# EAGLE design reader-and-latch-client-V2016-4-19 (EAGLE 7.5.0)
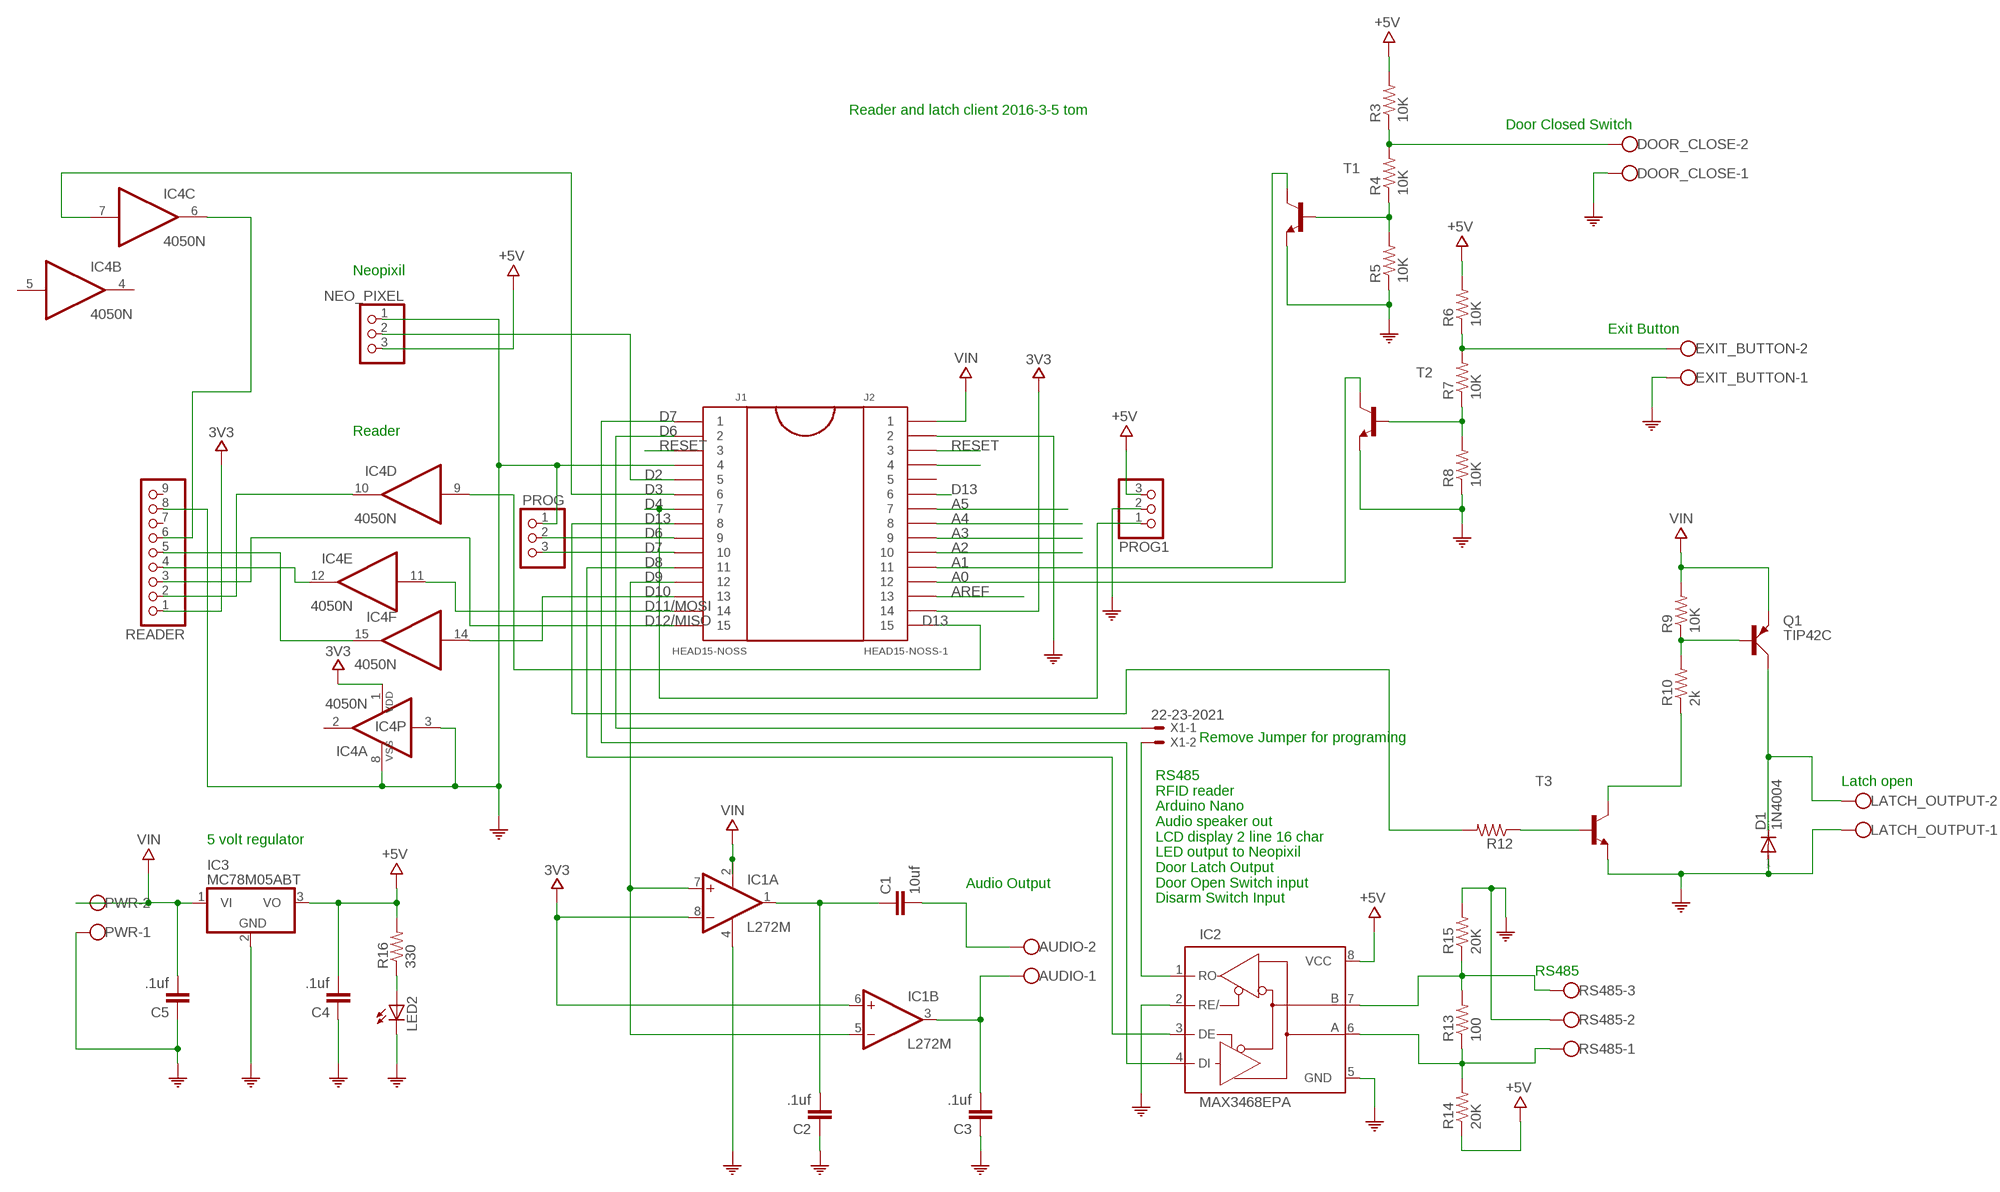
[diagram p0: schematic, sheet 1]

## Parts
AUDIO  W237-102  [W237-102]
C1  10uf  C22/6  [C22.5B6]
C2  .1uf  C5/2.5  [C5B2.5]
C3  .1uf  C5/2.5  [C5B2.5]
C4  .1uf  C5/2.5  [C5B2.5]
C5  .1uf  C5/2.5  [C5B2.5]
D1  1N4004  [DO41-10]
DOOR_CLOSE  W237-102  [W237-102]
EXIT_BUTTON  W237-102  [W237-102]
IC1  L272M  [DIL08]
IC2  MAX3468EPA  [DIL08]
IC3  MC78M05ABT  [TO220V]
IC4  4050N  [DIL16]
J1  HEAD15-NOSS  [HEAD15-NOSS]
J2  HEAD15-NOSS-1  [HEAD15-NOSS-1]
LATCH_OUTPUT  W237-102  [W237-102]
LED2  LED3MM  [LED3MM]
NEO_PIXEL  PINHD-1X3  [1X03]
PROG  PINHD-1X3  [1X03]
PROG1  PINHD-1X3  [1X03]
PWR  W237-102  [W237-102]
Q1  TIP42C  [TO220AV]
R3  10K  R-US_0207/10  [0207/10]
R4  10K  R-US_0207/10  [0207/10]
R5  10K  R-US_0207/10  [0207/10]
R6  10K  R-US_0207/10  [0207/10]
R7  10K  R-US_0207/10  [0207/10]
R8  10K  R-US_0207/10  [0207/10]
R9  10K  R-US_0207/10  [0207/10]
R10  2k  R-US_0207/10  [0207/10]
R12  R-US_0207/10  [0207/10]
R13  100  R-US_0207/10  [0207/10]
R14  20K  R-US_0207/10  [0207/10]
R15  20K  R-US_0207/10  [0207/10]
R16  330  R-US_0207/10  [0207/10]
READER  PINHD-1X9  [1X09]
RS485  W237-103  [W237-103]
T1  2N3904-NPN-TO92-EBC  [TO92-EBC]
T2  2N3904-NPN-TO92-EBC  [TO92-EBC]
T3  2N3904-NPN-TO92-EBC  [TO92-EBC]
X1  22-23-2021  [22-23-2021]

## Nets
3V3: IC1.6(B:+IN) IC1.8(A:-IN) IC4.1(P:VDD) J2.14 READER.1
+5V: C4.2 IC2.8(VCC) IC3.3(VO) NEO_PIXEL.3 PROG1.3 R3.2 R6.2 R14.1 R16.2
A0: J2.12 T2.C
A1: J2.11 T1.C
A2: J2.10
A3: J2.9
A4: J2.8
A5: J2.7
AREF: J2.13
COM: C2.1 C3.1 C4.1 C5.1 D1.A DOOR_CLOSE.1 EXIT_BUTTON.1 IC1.4(P:GND) IC2.2(RE/) IC2.5(GND) IC3.2(GND) IC4.3(A:I) IC4.8(P:VSS) J1.4 J2.2 LATCH_OUTPUT.1 LED2.K(C) NEO_PIXEL.1 PROG1.2 PROG.1 PWR.1 R5.1 R8.1 R15.2 READER.8 RS485.2 T1.E T2.E T3.E
D2: J1.5 NEO_PIXEL.2
D3: IC4.7(C:I) J1.6
D4: J1.7 PROG1.1
D6: J1.2 X1.1
D7: IC2.4(DI) J1.1
D8: IC2.3(DE) J1.11
D9: IC1.5(B:-IN) IC1.7(A:+IN) J1.12
D10: IC4.14(F:I) J1.13
D11/MOSI: IC4.11(E:I) J1.14
D12/MISO: J1.15 READER.3
D13: J1.8 R12.2
N$1: D1.C LATCH_OUTPUT.2 Q1.C
N$2: R12.1 T3.B
N$3: IC4.6(C:O) READER.6
N$4: IC2.7(B) R13.2 R15.1 RS485.3
N$5: IC2.6(A) R13.1 R14.2 RS485.1
N$6: J2.6
N$7: J1.9 PROG.2
N$8: J2.4
N$9: C1.1 C2.2 IC1.1(A:OUT)
N$10: AUDIO.2 C1.2
N$11: AUDIO.1 C3.2 IC1.3(B:OUT)
N$12: LED2.A R16.1
N$13: R4.1 R5.2 T1.B
N$14: DOOR_CLOSE.2 R3.1 R4.2
N$15: R7.1 R8.2 T2.B
N$16: EXIT_BUTTON.2 R6.1 R7.2
N$17: R10.1 T3.C
N$18: Q1.B R9.1 R10.2
N$19: IC4.10(D:O) READER.2
N$20: IC4.12(E:O) READER.4
N$21: IC4.15(F:O) READER.5
N$22: J1.10 PROG.3
N$23: IC4.9(D:I) J2.15
N$24: IC2.1(RO) X1.2
RESET: J1.3 J2.3
VIN: C5.2 IC1.2(P:V+) IC3.1(VI) J2.1 PWR.2 Q1.E R9.2
Unconnected: IC4.2(A:O) IC4.4(B:O) IC4.5(B:I) J2.5 READER.7 READER.9

## Notes on the sheet
- Reader and latch client 2016-3-5 tom
- Door Closed Switch
- Neopixil
- Exit Button
- Reader
- Remove Jumper for programing
- Latch open
- 5 volt regulator
- Audio Output
- RS485
  RFID reader
  Arduino Nano
  Audio speaker out
  LCD display 2 line 16 char
  LED output to Neopixil
  Door Latch Output
  Door Open Switch input
  Disarm Switch Input
- RS485

## Library data of the parts
AUDIO DOOR_CLOSE EXIT_BUTTON LATCH_OUTPUT PWR = con-wago-500:W237-102: WAGO SCREW CLAMP; MPN: 237-102; OC_FARNELL: unknown; OC_NEWARK: 70K9898
C1-C5 = capacitor-wima:C: CAPACITOR naming: grid - package width
D1 = diode:1N4004: DIODE general purpose rectifier, 1 A
IC1 = linear:L272: OP AMP
IC2 = maxim:MAX34*: +5V, Fail-Safe, 40Mbps, Profibus RS-485/RS-422 Transceivers Source: MAX3465-MAX3469.pdf; MPN: MAX3468EPA+; OC_FARNELL: unknown; OC_NEWARK: 78M5804
IC3 = linear:MC78M: 500 mA Positive Voltage Regulators Source: Data sheet <http://www.onsemi.com/pub_link/Collateral/MC78M00-D.PDF>
IC4 = 40xx:4050: Hex non-inverting BUFFER
J1 = MyCON2:HEAD15-NOSS
J2 = MyCON2:HEAD15-NOSS-1
LED2 = SparkFun-LED:LED: LEDs Standard schematic elements and footprints for 5mm, 3mm, 1206, and 0603 sized LEDs. 5mm - Spark Fun Electronics SKU : COM-00529 (and others)
NEO_PIXEL PROG PROG1 = pinhead:PINHD-1X3: PIN HEADER
Q1 = transistor-power:TIP42C: PNP TRANSISTOR
R3-R10 R12-R16 = resistor:R-US_: RESISTOR, American symbol
READER = pinhead:PINHD-1X9: PIN HEADER
RS485 = con-wago-500:W237-103: WAGO SCREW CLAMP; MPN: 237-103; OC_FARNELL: unknown; OC_NEWARK: 18M7116
T1-T3 = transistor-neu-to92:*-NPN-: NPN Transistror
X1 = con-molex:22-23-2021: .100" (2.54mm) Center Header - 2 Pin; MF: MOLEX; MPN: 22-23-2021; OC_FARNELL: 1462926; OC_NEWARK: 25C3832

## Board
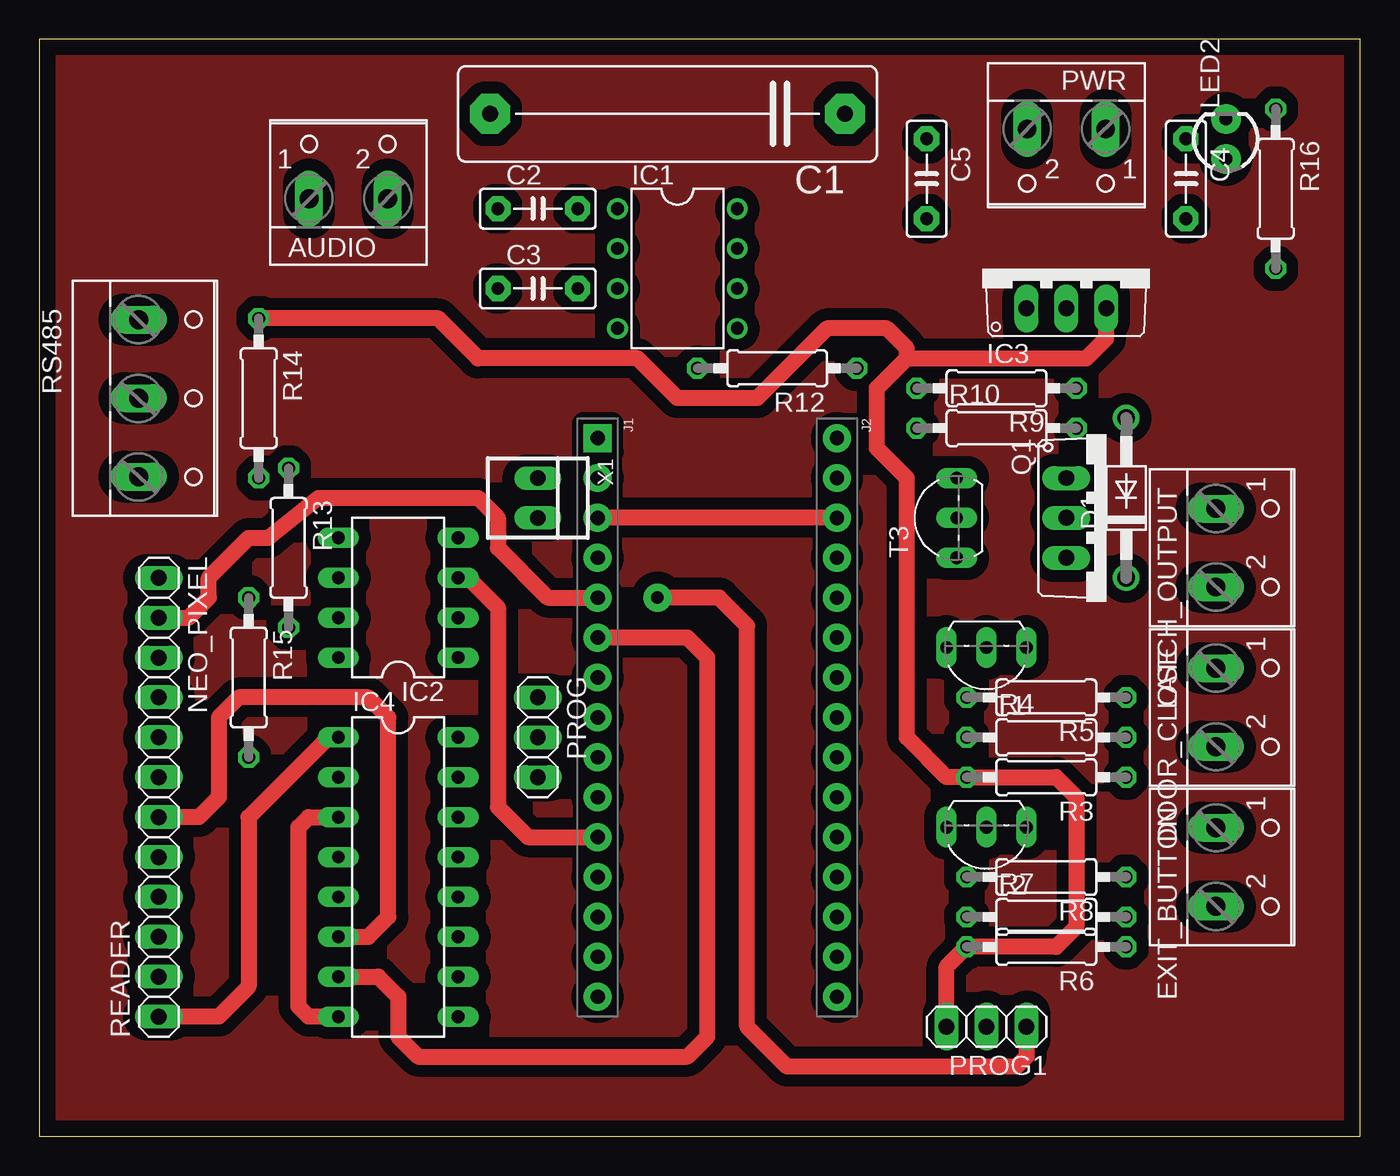
[diagram p1: board, top side]
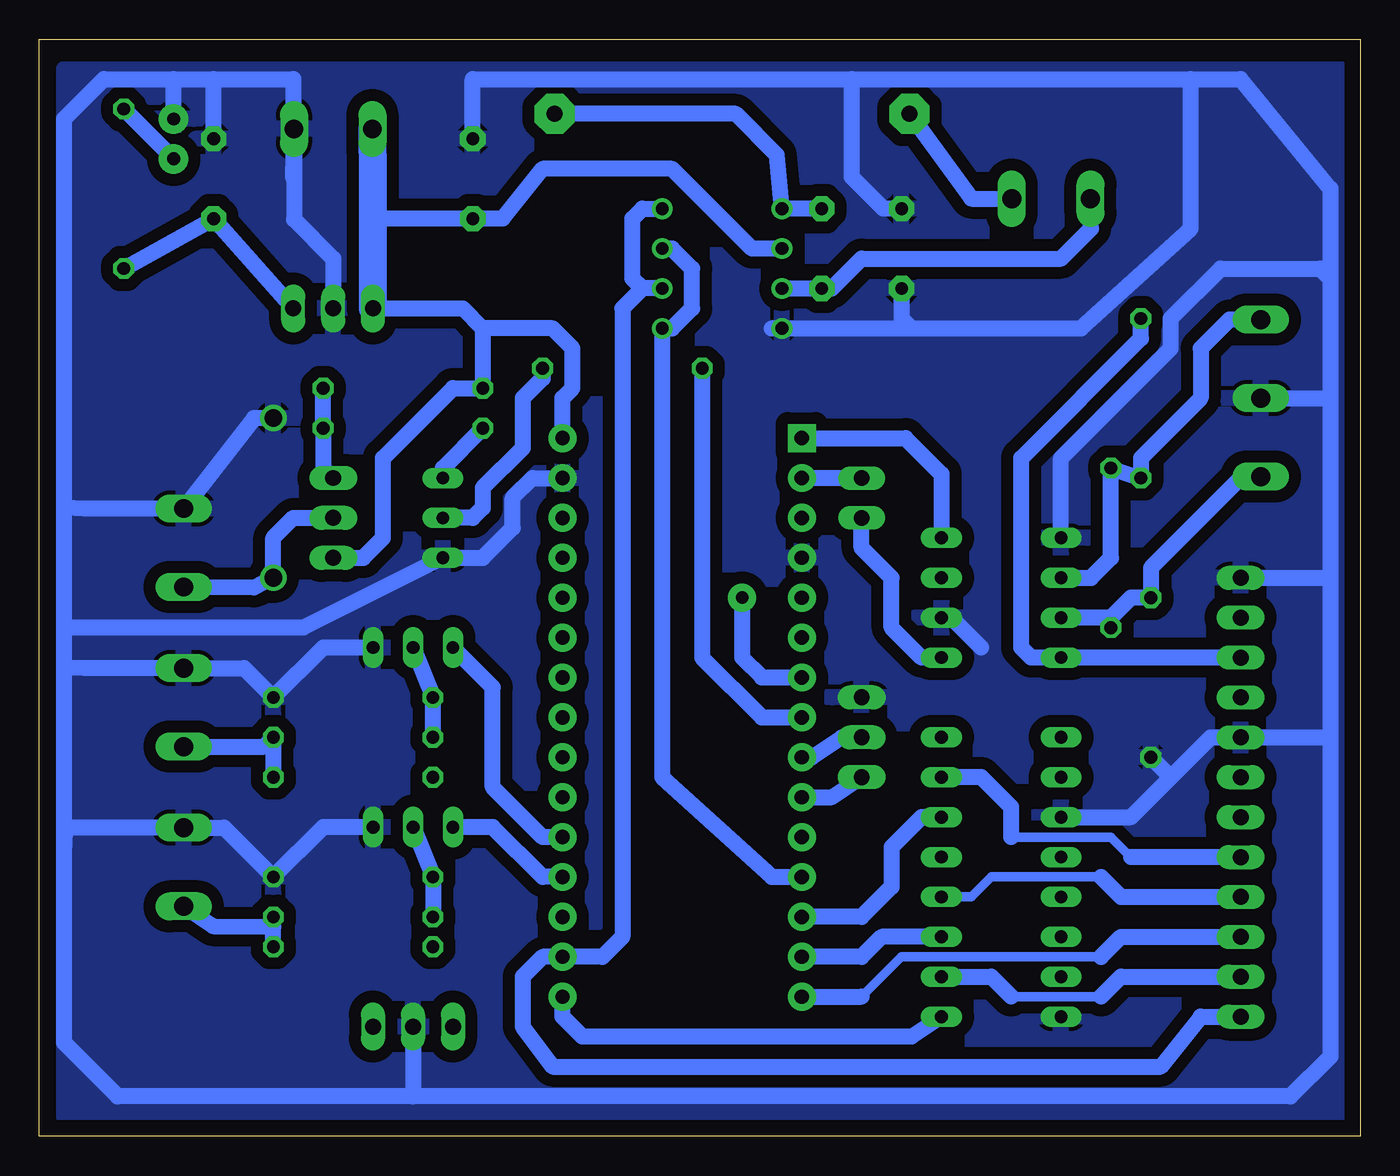
[diagram p2: board, bottom side, seen from below]

Size 84.12 x 69.84 mm. Coordinates in mm from the lower left corner, seen from the top.
Outline: 0,0 84.12,0 84.12,69.84 0,69.84 0,0
Copper layers (1*16): Top 0.035mm / dielectric 1.5mm / Bottom 0.035mm
Design rules "default *": minimum track width 10mil, minimum drill 24mil, track to track 30mil, track to pad 30mil, pad to pad 30mil, via to via 30mil, smd to smd 30mil, copper to edge 40mil, drill to drill 8mil, minimum pad ring 10mil, minimum via ring 8mil, stop-mask expansion 4mil, vias tented up to drill 0mil, thermal gap 10mil

### Footprints (pad centres in the part's own frame; a part is rotated, then mirrored left to right if it is on the bottom)
W237-102 = drill 1.194 long: 1 -2.5,-1.27; 2 2.5,-1.27
C22.5B6 = drill 1.016 pad 2.54 octagon: 1 -11.303,0; 2 11.303,0
C5B2.5 = drill 0.813 pad 1.6 octagon: 1 -2.54,0; 2 2.54,0
DO41-10 = drill 1.118: A 5.08,0; C -5.08,0
DIL08 = drill 0.813 pad 1.27: 1 -3.81,-3.81; 2 -1.27,-3.81; 3 1.27,-3.81; 4 3.81,-3.81; 5 3.81,3.81; 6 1.27,3.81; 7 -1.27,3.81; 8 -3.81,3.81
DIL08' = drill 0.813 long: 1 -3.81,-3.81; 2 -1.27,-3.81; 3 1.27,-3.81; 4 3.81,-3.81; 5 3.81,3.81; 6 1.27,3.81; 7 -1.27,3.81; 8 -3.81,3.81
TO220V = drill 1.016 long: 1 -2.54,-2.54; 2 0,-2.54; 3 2.54,-2.54
DIL16 = drill 0.813 long: 1 -8.89,-3.81; 2 -6.35,-3.81; 3 -3.81,-3.81; 4 -1.27,-3.81; 5 1.27,-3.81; 6 3.81,-3.81; 7 6.35,-3.81; 8 8.89,-3.81; 9 8.89,3.81; 10 6.35,3.81; 11 3.81,3.81; 12 1.27,3.81; 13 -1.27,3.81; 14 -3.81,3.81; 15 -6.35,3.81; 16 -8.89,3.81
HEAD15-NOSS = drill 0.914 pad 1.778 square: 1 0,0 | drill 0.914 pad 1.778: 2 2.54,0; 3 5.08,0; 4 7.62,0; 5 10.16,0; 6 12.7,0; 7 15.24,0; 8 17.78,0; 9 20.32,0; 10 22.86,0; 11 25.4,0; 12 27.94,0; 13 30.48,0; 14 33.02,0; 15 35.56,0
HEAD15-NOSS-1 = drill 0.914 pad 1.778: 1 0,0; 2 2.54,0; 3 5.08,0; 4 7.62,0; 5 10.16,0; 6 12.7,0; 7 15.24,0; 8 17.78,0; 9 20.32,0; 10 22.86,0; 11 25.4,0; 12 27.94,0; 13 30.48,0; 14 33.02,0; 15 35.56,0
LED3MM = drill 0.813 pad 1.88: A -1.27,0; K 1.27,0
1X03 = drill 1.016 long: 1 -2.54,0; 2 0,0; 3 2.54,0
TO220AV = drill 1.016 long: B -2.54,-2.54; C 0,-2.54; E 2.54,-2.54
0207/10 = drill 0.813 octagon: 1 -5.08,0; 2 5.08,0
1X09 = drill 1.016 long: 1 -10.16,0; 2 -7.62,0; 3 -5.08,0; 4 -2.54,0; 5 0,0; 6 2.54,0; 7 5.08,0; 8 7.62,0; 9 10.16,0
W237-103 = drill 1.194 long: 1 -5,-1.29; 2 0,-1.29; 3 5,-1.29
TO92-EBC = drill 0.813 long: B 0,-1.27; C 2.54,-1.27; E -2.54,-1.27
22-23-2021 = drill 1 long: 1 -1.27,0; 2 1.27,0

### Placement (x,y rotation side)
AUDIO  19.68,60.96 0 top
C1  40.01,65.09 180 top
C2  31.75,59.05 0 top
C3  31.75,53.98 0 top
C4  73.03,60.96 270 top
C5  56.52,60.96 270 top
D1  69.22,40.64 90 top
DOOR_CLOSE  76.2,27.3 270 top
EXIT_BUTTON  76.2,17.14 270 top
IC1  40.64,55.24 270 top
IC2  MAX3468EPA  [DIL08']  22.86,34.29 90 top
IC3  65.41,55.24 0 top
IC4  22.86,16.51 270 top
J1  35.56,44.45 270 top
J2  50.8,44.45 270 top
LATCH_OUTPUT  76.2,37.47 270 top
LED2  75.56,63.5 90 top
NEO_PIXEL  7.62,33.02 270 top
PROG  31.75,25.4 270 top
PROG1  60.33,6.99 180 top
PWR  65.41,62.87 180 top
Q1  67.94,39.37 270 top
R3  64.14,22.86 180 top
R4  64.14,25.4 0 top
R5  64.14,27.94 180 top
R6  64.14,12.06 180 top
R7  64.14,13.97 0 top
R8  64.14,16.51 180 top
R9  60.96,47.62 180 top
R10  60.96,45.09 0 top
R12  46.99,48.9 180 top
R13  15.88,37.47 270 top
R14  13.97,46.99 270 top
R15  13.34,29.21 270 top
R16  78.74,60.33 270 top
READER  7.62,17.78 90 top
RS485  7.62,46.99 270 top
T1  60.33,29.84 180 top
T2  60.33,18.41 180 top
T3  57.15,39.37 90 top
X1  31.75,40.64 270 top

### Tracks (layer width: path | path; a pad name or v marks a point on that pad's centre or on a via)
3V3
  Top 1.016: IC4.1 18.41,25.4 13.34,20.32 13.34,9.53 11.43,7.62 READER.1
  Bottom 1.016: READER.1 10.16,7.62 12.7,4.45 51.44,4.45 53.34,6.99 53.34,10.16 52.07,11.43 J2.14 48.26,11.43 46.99,12.7 46.99,52.7 45.72,53.98 | IC1.6 45.72,53.98 | 45.72,53.98 46.35,54.61 46.35,58.42 45.72,59.05 IC1.8
+5V
  Top 1.016: 55.24,49.53 66.67,49.53 67.94,50.8 IC3.3 | 55.24,49.53 53.34,47.62 53.34,43.81 55.24,41.91 55.24,25.4 57.78,22.86 R3.2 64.77,22.86 66.04,21.59 66.04,13.34 64.77,12.06 R6.2 57.78,10.79 PROG1.3 | 55.24,49.53 55.24,50.16 53.98,51.44 50.16,51.44 45.72,46.99 40.64,46.99 38.1,49.53 27.94,49.53 25.4,52.07 R14.1
  Bottom 1.016: R16.2 C4.2 IC3.3 | NEO_PIXEL.3 IC2.8 20.95,30.48 21.59,31.11 21.59,43.18 13.97,50.8 R14.1
A0
  Bottom 1.016: J2.12 52.07,16.51 55.24,19.68 T2.C
A1
  Bottom 1.016: J2.11 52.07,19.05 55.24,22.23 55.24,28.57 T1.C
COM
  Top 1.016: IC4.8 17.14,7.62 16.51,8.26 16.51,19.68 17.14,20.32 IC4.3
  Bottom 1.016: 37.47,51.44 IC1.4 28.57,51.44 | IC4.3 14.61,20.32 12.06,22.86 | 12.06,22.86 9.53,25.4 READER.8 1.91,25.4 | R15.2 12.06,22.86 | C5.1 56.52,67.31 32.38,67.31 | 32.38,67.31 10.79,67.31 | 10.79,67.31 7.62,67.31 1.91,60.33 1.91,54.61 | 1.91,54.61 1.91,46.99 | 1.91,46.99 1.91,35.56 | 1.91,35.56 1.91,25.4 | 1.91,25.4 1.91,5.08 4.45,2.54 60.33,2.54 | 60.33,2.54 79.13,2.54 82.55,5.96 82.55,18.41 | 82.55,18.41 82.55,29.84 | 82.55,29.84 82.55,32.38 | 82.55,32.38 82.55,40.01 | 82.55,40.01 82.55,64.77 80.01,67.31 75.56,67.31 | 75.56,67.31 73.03,67.31 | 73.03,67.31 67.94,67.31 67.94,61 PWR.1 67.91,58.38 65.41,55.88 IC3.2 | C4.1 73.03,67.31 | LED2.K 75.56,67.31 | 82.55,40.01 81.24,39.97 LATCH_OUTPUT.1 70.44,45.72 D1.A | 82.55,29.84 81.24,29.8 DOOR_CLOSE.1 71.08,29.8 R5.1 66.04,31.11 T1.E | 82.55,18.41 82.51,19.64 EXIT_BUTTON.1 72.35,19.64 R8.1 66.04,19.68 T2.E | 82.55,32.38 67.31,32.38 T3.E 55.88,36.83 53.98,38.73 53.98,40.64 52.7,41.91 J2.2 | 28.57,51.44 17.78,51.44 10.79,57.78 10.79,67.31 | C3.1 29.21,52.07 28.57,51.44 | C2.1 30.38,59.05 32.38,61.06 32.38,67.31 | RS485.2 1.91,46.99 | NEO_PIXEL.1 1.91,35.56 | IC2.5 19.05,43.18 12.06,50.16 12.06,52.07 8.89,55.24 2.54,55.24 1.91,54.61 | PROG1.2 60.33,2.54 | IC2.2 26.04,33.02 24.13,31.11
  pour Bottom: 0.64,1.27 82.55,1.27 82.55,67.94 1.27,67.94
D2
  Top 1.016: NEO_PIXEL.2 9.53,33.02 10.79,34.29 10.79,35.56 13.34,38.1 14.61,38.1 17.78,40.64 27.94,40.64 29.21,39.37 29.21,37.47 32.38,34.29 J1.5
D3
  Top 1.016: IC4.7 21.59,10.16 22.86,8.89 22.86,6.35 24.13,5.08 41.27,5.08 42.55,6.35 42.55,30.48 41.27,31.75 J1.6
D4  (via drill 0.8 pad 1.78)
  Top 1.016: PROG1.1 62.87,5.08 62.23,4.45 47.62,4.45 45.09,6.99 45.09,32.49 43.29,34.29 v39.37,34.29
  Bottom 1.016: v39.37,34.29 39.37,30.48 38.1,29.21 J1.7
D6
  Bottom 1.016: 31.11,41.91 X1.1 J1.2
D7
  Bottom 1.016: J1.1 28.96,44.45 26.67,42.16 IC2.4
D8
  Top 1.016: IC2.3 27.3,35.56 29.21,33.66 29.21,20.95 31.11,19.05 J1.11
D9
  Bottom 1.016: J1.12 37.47,16.51 44.45,22.86 IC1.5 43.81,51.44 42.55,52.7 42.55,55.24 43.81,56.52 IC1.7
D10
  Bottom 1.016: IC4.14 27.94,20.32 29.84,18.41 29.84,15.88 31.75,13.97 J1.13
D11/MOSI
  Bottom 1.016: IC4.11 30.48,12.7 31.75,11.43 J1.14
D12/MISO
  Bottom 0.61: 31.75,8.89 29.21,11.43 16.51,11.43
  Bottom 1.016: J1.15 31.75,8.89 | 16.51,11.43 15.24,12.7 READER.3
D13
  Bottom 1.016: R12.2 41.91,30.48 38.1,26.67 J1.8
GND
  pour Top: 0.64,69.22 83.82,69.22 83.82,0.64 0.64,0.64
N$1
  Bottom 1.016: LATCH_OUTPUT.2 70.44,34.92 D1.C 69.22,38.1 67.94,39.37 Q1.C
N$2
  Bottom 1.016: R12.1 52.07,48.26 53.34,46.99 53.34,43.81 55.88,41.27 55.88,40.01 56.52,39.37 T3.B
N$3
  Top 1.016: IC4.6 20.95,12.7 22.23,13.97 22.23,26.67 20.95,27.94 12.7,27.94 11.43,26.67 11.43,21.59 10.16,20.32 READER.6
N$4
  Bottom 1.016: RS485.3 7.54,41.99 13.34,36.2 R15.1 14.61,34.29 15.88,33.02 | 15.88,33.02 IC2.7 | R13.2 15.88,33.02
N$5
  Bottom 1.016: IC2.6 17.14,35.56 15.88,36.83 R13.1 R14.2 13.97,43.18 10.16,46.99 10.16,50.16 8.34,51.99 RS485.1
N$7
  Bottom 1.016: J1.9 34.92,24.13 33.02,25.4 PROG.2
N$9
  Bottom 1.016: C2.2 IC1.1 37.15,62.47 39.77,65.09 C1.1
N$10
  Bottom 1.016: C1.2 24.77,59.69 AUDIO.2
N$11
  Bottom 1.016: IC1.3 C3.2 33.66,53.98 31.75,55.88 19.05,55.88 17.14,57.78 17.14,59.65 AUDIO.1
N$12
  Bottom 1.016: R16.1 LED2.A
N$13
  Bottom 1.016: T1.B R5.2 R4.1
N$14
  Bottom 1.016: R3.1 R4.2 69.81,24.8 DOOR_CLOSE.2
N$15
  Bottom 1.016: T2.B R8.2 R7.1
N$16
  Bottom 1.016: R6.1 69.22,13.34 | 69.22,13.34 R7.2 | EXIT_BUTTON.2 73.06,13.38 69.22,13.34
N$17
  Bottom 1.016: T3.C 58.42,42.55 R10.1
N$18
  Bottom 1.016: R9.1 R10.2 66.04,42.55 Q1.B
N$19
  Bottom 0.61: 22.23,8.89 16.51,8.89
  Bottom 1.016: IC4.10 23.5,10.16 22.23,8.89 | 16.51,8.89 15.24,10.16 READER.2
N$20
  Bottom 0.61: IC4.12 24.77,15.24 23.5,16.51 16.51,16.51
  Bottom 1.016: 16.51,16.51 15.24,15.24 READER.4
N$21
  Bottom 0.61: 14.61,17.78 15.88,19.05 22.23,19.05
  Bottom 1.016: READER.5 14.61,17.78 | 22.23,19.05 22.23,20.95 24.13,22.86 IC4.15
N$22
  Bottom 1.016: J1.10 33.66,21.59 PROG.3
N$23
  Bottom 1.016: IC4.9 28.57,6.35 49.53,6.35 50.8,7.62 J2.15
N$24
  Bottom 1.016: IC2.1 27.94,30.48 29.84,32.38 29.84,35.56 31.75,37.47 X1.2
RESET
  Top 1.016: J2.3 J1.3
VIN
  Bottom 1.016: 62.87,58.42 C5.2 54.61,58.42 52.07,61.59 43.81,61.59 38.73,56.52 IC1.2 | Q1.E 63.5,36.83 62.23,38.1 62.23,43.18 57.78,47.62 R9.2 55.88,51.44 | J2.1 50.8,46.99 50.16,47.62 50.16,50.16 51.44,51.44 55.88,51.44 | IC3.1 57.15,52.7 55.88,51.44
  Bottom 1.778: IC3.1 62.87,58.42 62.87,61 PWR.2